# Altium schematic sheet Display.SchDoc
size A4; SheetNumber: 2; SheetTotal: 4
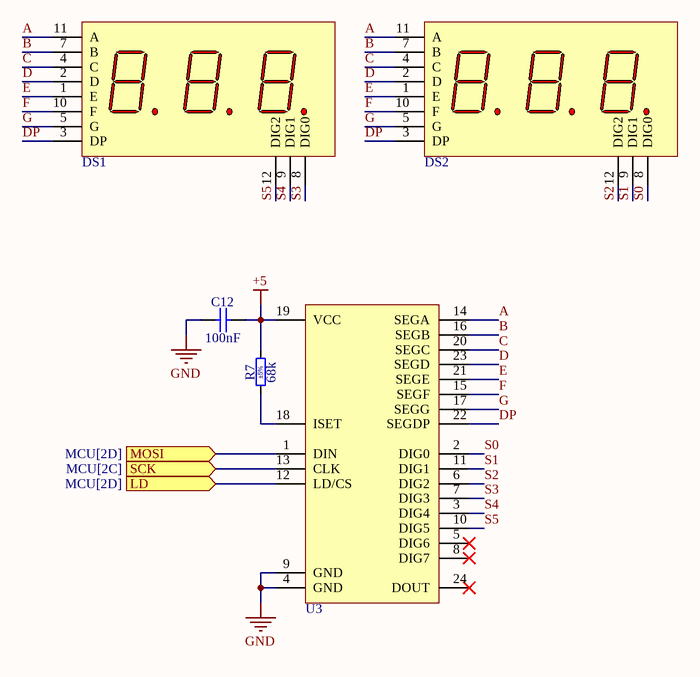
[diagram p0: Display.SchDoc]

## Parts
C12  100nF  [CAPC2012X135N]
DS1  7SEGMENT-3DIG-CC  [7SEGMENT-3DIG]  (value not drawn)
DS2  7SEGMENT-3DIG-CC  [7SEGMENT-3DIG]  (value not drawn)
R7  68k  Tolerance: ±5%  [RESC2012X60N]
U3  MAX7219CWG+  [SOIC-24W]  (value not drawn)

## Ports
LD (in, see MCU[2D]), MOSI (in, see MCU[2D]), SCK (in, see MCU[2C])

## Nets
+5: C12.2 R7.2 U3.19(VCC)
GND: C12.1 U3.4(GND) U3.9(GND)
A: DS1.11(A) DS2.11(A) U3.14(SEGA)
B: DS1.7(B) DS2.7(B) U3.16(SEGB)
C: DS1.4(C) DS2.4(C) U3.20(SEGC)
D: DS1.2(D) DS2.2(D) U3.23(SEGD)
DP: DS1.3(DP) DS2.3(DP) U3.22(SEGDP)
E: DS1.1(E) DS2.1(E) U3.21(SEGE)
F: DS1.10(F) DS2.10(F) U3.15(SEGF)
G: DS1.5(G) DS2.5(G) U3.17(SEGG)
LD: U3.12(LD/CS) ; port LD
MOSI: U3.1(DIN) ; port MOSI
S0: DS2.8(DIG0) U3.2(DIG0)
S1: DS2.9(DIG1) U3.11(DIG1)
S2: DS2.12(DIG2) U3.6(DIG2)
S3: DS1.8(DIG0) U3.7(DIG3)
S4: DS1.9(DIG1) U3.3(DIG4)
S5: DS1.12(DIG2) U3.10(DIG5)
SCK: U3.13(CLK) ; port SCK
NetR7_1: R7.1 U3.18(ISET)

Not connected (* = marked no-connect by the designer): U3 5(DIG6)* 8(DIG7)* 24(DOUT)*

## Library data of the parts
C12 = CC0805_100NF_50V_10%_X7R: Non-polarised capacitor; Part Description: SMD Multilayer Chip Ceramic Capacitor; Manufacturer: GENERIC; Manufacturer1 Part Number: C2012X7R1H104K085; Voltage: 50V; TC: X7R; Tolerance: ±10%; Part Number: CC0805_100NF_50V_10%_X7R; Component Kind: Standard; Component Type: Standard; Pin Count: 2; Value: 100nF; Status: None; Manufacturer Part Number: CC0805_100NF_50V_10%_X7R; Case: 0805; Mounted: Yes; Socket: No; SMD: Yes; Sense: No; Manufacturer1 Example: TDK; Manufacturer1 ComponentHeight: 1mm; HelpURL: \\cern.ch\dfs\Applications\Altium\Datasheets\CC0805_X7R_TDK_C.pdf; Author: CERN DEM JLC; CreateDate: 3.12.2007; LatestRevisionDate: 22.04.2015
R7 = R0805_68K_1%_0.125W_100PPM: Resistor - 5%; Part Description: General Purpose Thick Film Chip Resistor; Manufacturer: GENERIC; Manufacturer Part Number: R0805_68K_5%_0.125W_100PPM; Manufacturer1 Part Number: NRC10F6802TRF; Power: 0.125W; TC: ±100ppm/°C; PressFit: No; Part Number: R0805_68K_1%_0.125W_100PPM; Component Kind: Standard; Component Type: Standard; Pin Count: 2; Value: 68k; Status: Preferred; Case: 0805; Mounted: Yes; Sense: No; Socket: No; SMD: Yes; Manufacturer1 Example: NIC COMPONENT; Manufacturer1 ComponentHeight: 0.6mm; HelpURL: \\cern.ch\dfs\Applications\Altium\Datasheets\R0805_NIC_NRC.pdf; Author: CERN DEM JLC; CreateDate: 3.12.2007; LatestRevisionDate: 13.03.2008
U3 = MAX7219CWG+: LED Driver, 7-Segment, MOS, PDSO24; Manufacturer: Maxim; Package Body Material: Plastic; Output Polarity: True; Data Input Mode: SERIAL; fmax-Min: 1.3MHz; Input Characteristics: STANDARD; Interface IC Type: LED DISPLAY DRIVER; Multiplexed Display Capability: Yes; Number of Digits/Characters: 8; Channels: 1; Number of Segments: 7; Output Characteristics: TOTEM-POLE; Package Equivalence Code: SOP24,.4; Power Supplies: 5V; Max Supply Voltage: 5.5V; Min Supply Voltage: 4V; Qualification Status: Not Qualified; Supplier: Mouser; Supplier Part Number: 700-MAX7219CWG; Manufacturer Part Number: MAX7219CWG+; RoHS: Yes; Category: LED Drivers; Stock: 1573; Pricing: 1=13,84, 10=12,72, 50=12,2, 100=12,2, 1000=9,56, 10000=9,56 (USD); Case/Package: SOP; Pins: 24; Package Shape: Rectangular; Terminal Finish: Tin; Min Operating Temperature: 0°C; Max Operating Temperature: 70°C; JESD-609 Code: e3; Display Mode: Segment; JESD-30 Code: R-PDSO-G24; Moisture Sensitivity Level: 1; Package Style: SMALL OUTLINEMeter; Peak Reflow Temperature (Cel): 260°C; Nominal Supply Voltage: 5V; Surface Mount: Yes; Technology: MOS; Terminal Form: Gull Wing; Terminal Position: DUAL; Length: 15.4mm; Width: 7.5mm; Height - Seated (Max): 2.65mm; Terminal Pitch: 1.27mm; Temperature Grade: COMMERCIAL; Reach SVHC Compliant: Yes; RoHS Compliant: Yes; ComponentLink1URL: https://datasheet.ciiva.com:443/pdfs/VipMasterIC/IC/MAXM/MAXMS13376/MAXMS13376-1.pdf?src-supplier=IHS+Markit; ComponentLink1Description: https://datasheet.ciiva.com:443/pdfs/VipMasterIC/IC/MAXM/MAXMS13376/MAXMS13376-1.pdf?src-supplier=IHS+Markit; ComponentLink2URL: https://www.distrelec.biz/Web/Downloads/_t/ds/max7219_21_eng_tds.pdf?mime=application%2Fpdf&src-supplier=Distrelec; ComponentLink2Description: https://www.distrelec.biz/Web/Downloads/_t/ds/max7219_21_eng_tds.pdf?mime=application%2Fpdf&src-supplier=Distrelec
DS1 DS2 = 7SEGMENT-3DIG-CC: ComponentLink1Description: Ozdisan Link; ComponentLink1URL: https://ozdisan.com/tft-lcd-ve-led-ekranlar/led-ekran-modulleri/karakter-ve-numerik-led-displayler/E1-3056-CUR-1-CT/387322